# Altium project Switchberry.PrjPcb (part 3 of 3)

## Sheet 13-I225_2.SchDoc
size B; SheetNumber: 13; SheetTotal: 13
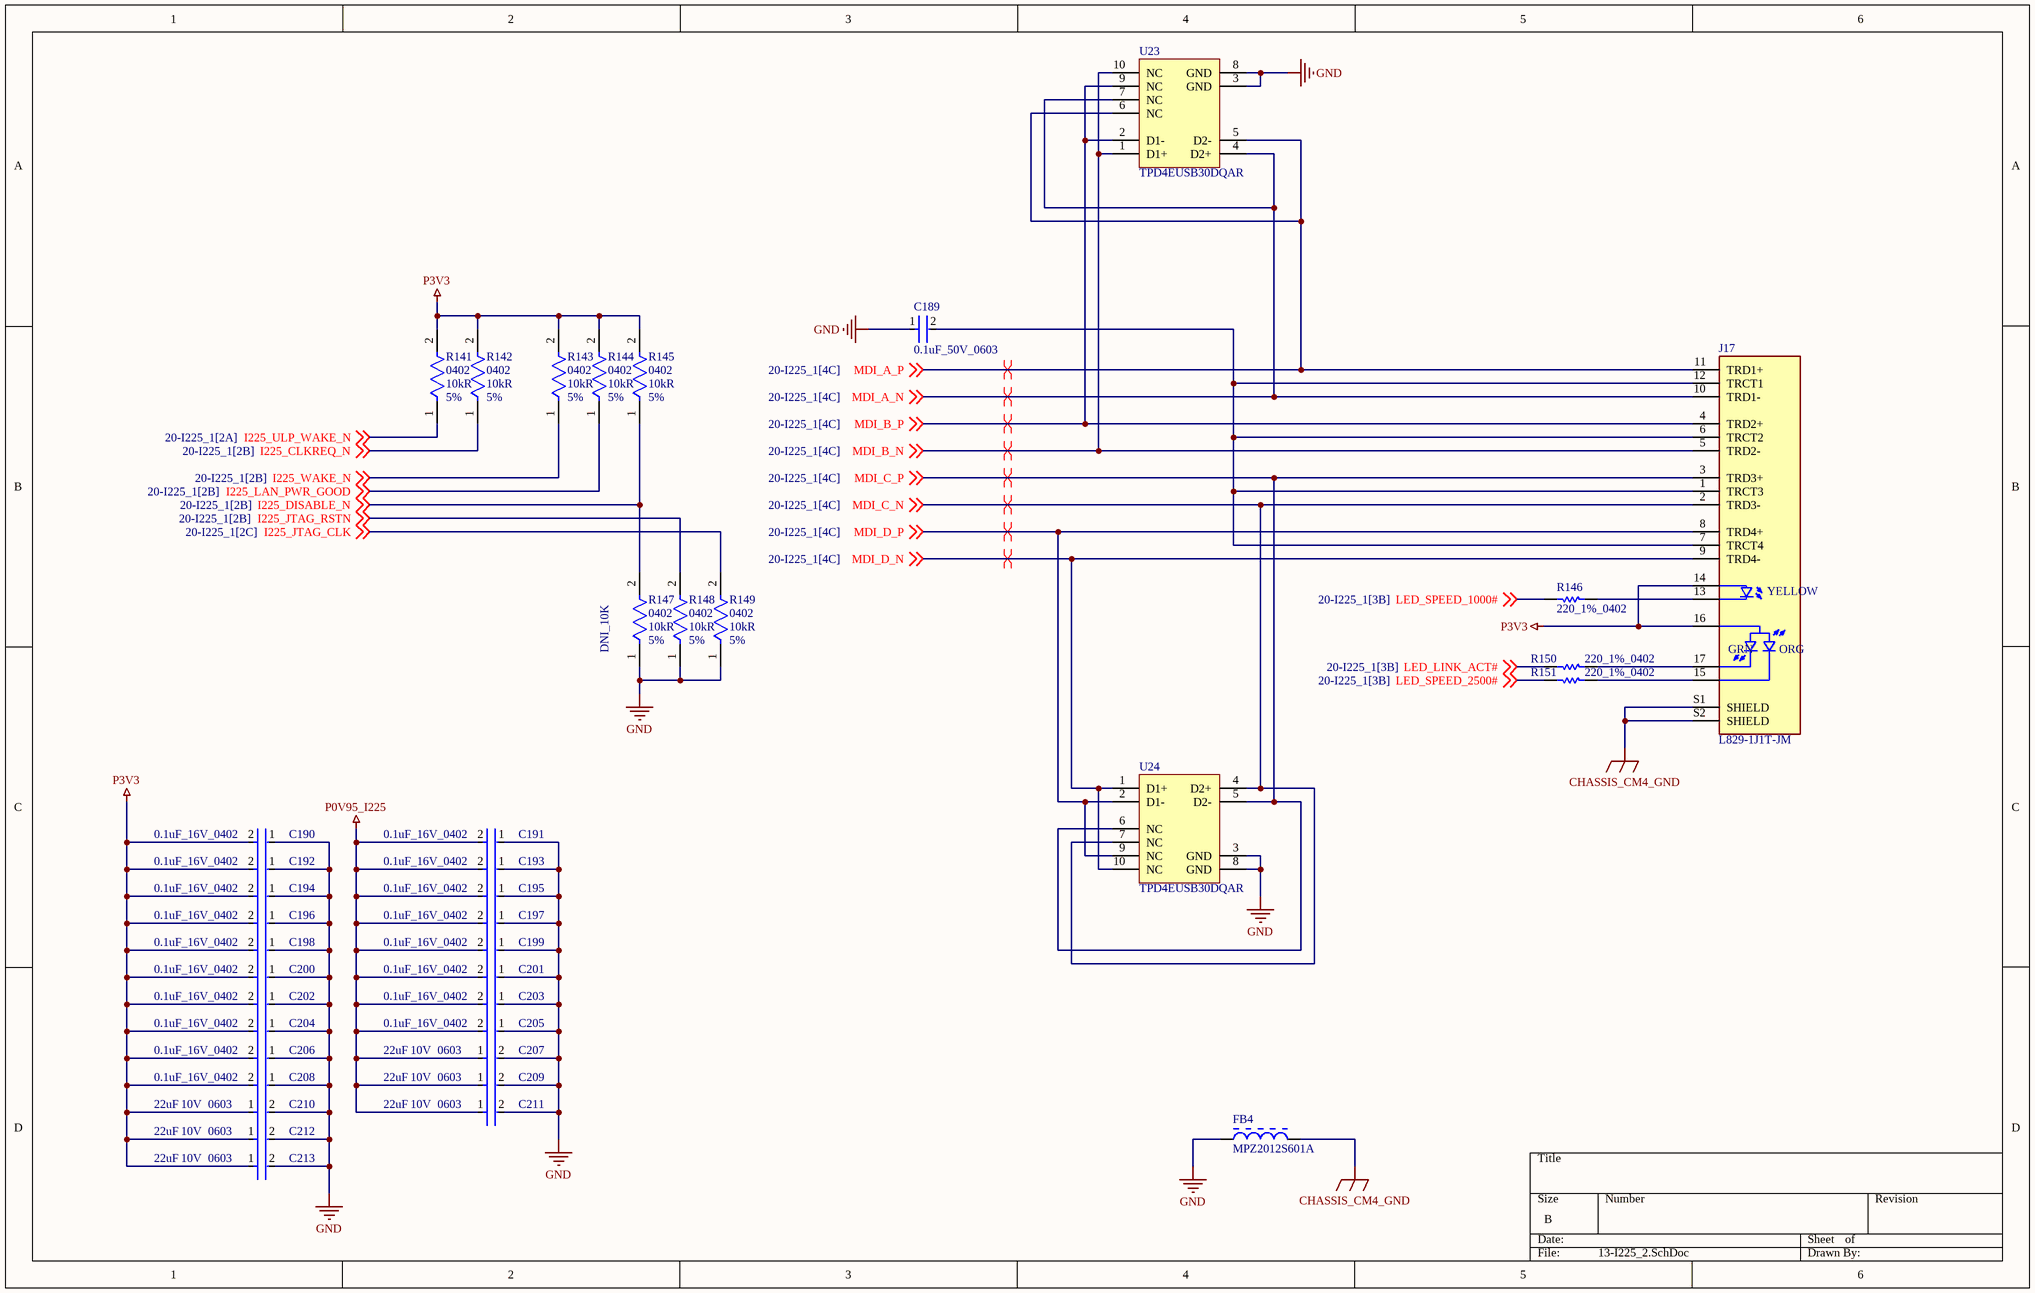
[diagram p9: 13-I225_2.SchDoc]

### Parts
C189  0.1uF_50V_0603  [FP-C0603-CJ-MFG]
C190  0.1uF_16V_0402  [FP-GRM15-MFG]
C191  0.1uF_16V_0402  [FP-GRM15-MFG]
C192  0.1uF_16V_0402  [FP-GRM15-MFG]
C193  0.1uF_16V_0402  [FP-GRM15-MFG]
C194  0.1uF_16V_0402  [FP-GRM15-MFG]
C195  0.1uF_16V_0402  [FP-GRM15-MFG]
C196  0.1uF_16V_0402  [FP-GRM15-MFG]
C197  0.1uF_16V_0402  [FP-GRM15-MFG]
C198  0.1uF_16V_0402  [FP-GRM15-MFG]
C199  0.1uF_16V_0402  [FP-GRM15-MFG]
C200  0.1uF_16V_0402  [FP-GRM15-MFG]
C201  0.1uF_16V_0402  [FP-GRM15-MFG]
C202  0.1uF_16V_0402  [FP-GRM15-MFG]
C203  0.1uF_16V_0402  [FP-GRM15-MFG]
C204  0.1uF_16V_0402  [FP-GRM15-MFG]
C205  0.1uF_16V_0402  [FP-GRM15-MFG]
C206  0.1uF_16V_0402  [FP-GRM15-MFG]
C207  Capacitance: 22uF  Voltage Rating: 10V  Case Code (Imperial): 0603  [FP-GRM188-0_2-IPC_C]  (hidden comment: GRM188R61A226ME15D)
C208  0.1uF_16V_0402  [FP-GRM15-MFG]
C209  Capacitance: 22uF  Voltage Rating: 10V  Case Code (Imperial): 0603  [FP-GRM188-0_2-IPC_C]  (hidden comment: GRM188R61A226ME15D)
C210  Capacitance: 22uF  Voltage Rating: 10V  Case Code (Imperial): 0603  [FP-GRM188-0_2-IPC_C]  (hidden comment: GRM188R61A226ME15D)
C211  Capacitance: 22uF  Voltage Rating: 10V  Case Code (Imperial): 0603  [FP-GRM188-0_2-IPC_C]  (hidden comment: GRM188R61A226ME15D)
C212  Capacitance: 22uF  Voltage Rating: 10V  Case Code (Imperial): 0603  [FP-GRM188-0_2-IPC_C]  (hidden comment: GRM188R61A226ME15D)
C213  Capacitance: 22uF  Voltage Rating: 10V  Case Code (Imperial): 0603  [FP-GRM188-0_2-IPC_C]  (hidden comment: GRM188R61A226ME15D)
FB4  MPZ2012S601A  [TDK-MPZ2012_V]
J17  L829-1J1T-JM  [BEL_L829-1J1T-JM]
R141  Case/Package: 0402  Resistance: 10kR  Tolerance: 5%  [FP-CRCW0402-e3-IPC_B]  (hidden comment: CRCW040210K0JNED)
R142  Case/Package: 0402  Resistance: 10kR  Tolerance: 5%  [FP-CRCW0402-e3-IPC_B]  (hidden comment: CRCW040210K0JNED)
R143  Case/Package: 0402  Resistance: 10kR  Tolerance: 5%  [FP-CRCW0402-e3-IPC_B]  (hidden comment: CRCW040210K0JNED)
R144  Case/Package: 0402  Resistance: 10kR  Tolerance: 5%  [FP-CRCW0402-e3-IPC_B]  (hidden comment: CRCW040210K0JNED)
R145  Case/Package: 0402  Resistance: 10kR  Tolerance: 5%  [FP-CRCW0402-e3-IPC_B]  (hidden comment: CRCW040210K0JNED)
R146  220_1%_0402  [RESC1005X40X25LL10T10]
R147  DNI_10K  Case/Package: 0402  Resistance: 10kR  Tolerance: 5%  [FP-CRCW0402-e3-IPC_B]  (no BOM)
R148  Case/Package: 0402  Resistance: 10kR  Tolerance: 5%  [FP-CRCW0402-e3-IPC_B]  (hidden comment: CRCW040210K0JNED)
R149  Case/Package: 0402  Resistance: 10kR  Tolerance: 5%  [FP-CRCW0402-e3-IPC_B]  (hidden comment: CRCW040210K0JNED)
R150  220_1%_0402  [RESC1005X40X25LL10T10]
R151  220_1%_0402  [RESC1005X40X25LL10T10]
U23  TPD4EUSB30DQAR  [DQA0010A_V]
U24  TPD4EUSB30DQAR  [DQA0010A_V]

### Nets
CHASSIS_CM4_GND: FB4.2 J17.S1(SHIELD) J17.S2(SHIELD)
GND: C189.1 C190.1 C191.1 C192.1 C193.1 C194.1 C195.1 C196.1 C197.1 C198.1 C199.1 C200.1 C201.1 C202.1 C203.1 C204.1 C205.1 C206.1 C207.2 C208.1 C209.2 C210.2 C211.2 C212.2 C213.2 FB4.1 R147.1 R148.1 R149.1 U23.3(GND) U23.8(GND) U24.3(GND) U24.8(GND)
P0V95_I225: C191.2 C193.2 C195.2 C197.2 C199.2 C201.2 C203.2 C205.2 C207.1 C209.1 C211.1
P3V3: C190.2 C192.2 C194.2 C196.2 C198.2 C200.2 C202.2 C204.2 C206.2 C208.2 C210.1 C212.1 C213.1 J17.14(YA_1) J17.16(CA) R141.2 R142.2 R143.2 R144.2 R145.2
I225_CLKREQ_N: R142.1 ; off-sheet I225_CLKREQ_N
I225_DISABLE_N: R145.1 R147.2 ; off-sheet I225_DISABLE_N
I225_JTAG_CLK: R149.2 ; off-sheet I225_JTAG_CLK
I225_JTAG_RSTN: R148.2 ; off-sheet I225_JTAG_RSTN
I225_LAN_PWR_GOOD: R144.1 ; off-sheet I225_LAN_PWR_GOOD
I225_ULP_WAKE_N: R141.1 ; off-sheet I225_ULP_WAKE_N
I225_WAKE_N: R143.1 ; off-sheet I225_WAKE_N
LED_LINK_ACT#: R150.2 ; off-sheet LED_LINK_ACT#
LED_SPEED_1000#: R146.2 ; off-sheet LED_SPEED_1000#
LED_SPEED_2500#: R151.2 ; off-sheet LED_SPEED_2500#
MDI_A_N: J17.10(TRD1-) U23.4(D2+) U23.7(NC) ; off-sheet MDI_A_N
MDI_A_P: J17.11(TRD1+) U23.5(D2-) U23.6(NC) ; off-sheet MDI_A_P
MDI_B_N: J17.5(TRD2-) U23.1(D1+) U23.10(NC) ; off-sheet MDI_B_N
MDI_B_P: J17.4(TRD2+) U23.2(D1-) U23.9(NC) ; off-sheet MDI_B_P
MDI_C_N: J17.2(TRD3-) U24.4(D2+) U24.7(NC) ; off-sheet MDI_C_N
MDI_C_P: J17.3(TRD3+) U24.5(D2-) U24.6(NC) ; off-sheet MDI_C_P
MDI_D_N: J17.9(TRD4-) U24.1(D1+) U24.10(NC) ; off-sheet MDI_D_N
MDI_D_P: J17.8(TRD4+) U24.2(D1-) U24.9(NC) ; off-sheet MDI_D_P
NetC189_2: C189.2 J17.1(TRCT3) J17.6(TRCT2) J17.7(TRCT4) J17.12(TRCT1)
NetJ17_13: J17.13(YK_1) R146.1
NetJ17_15: J17.15(OK_1) R151.1
NetJ17_17: J17.17(GK_1) R150.1

### Layout directives
differential pair: MDI_A_N, MDI_A_P, MDI_B_N, MDI_B_P, MDI_C_N, MDI_C_P, MDI_D_N, MDI_D_P

### Notes on the sheet
- (in symbol L829-1J1T-JM) YELLOW; GRN; ORG

### Library data of the parts
C189 = CMP-2006-03300-2: CAP CER 0.1UF 50V X7R 0603; Manufacturer Part Number: C0603X104K5RACTU; Manufacturer: Kemet; Capacitance: 100nF; Material: Ceramic; Tolerance: 10%; Value: 100nF; Temperature Coefficient: 15%; Temperature Range High: +125°C; Temperature Range Low: -55°C; Voltage: 50V; ComponentLink2Description: Datasheet; RoHS: TRUE; ComponentLink2URL: https://content.kemet.com/datasheets/KEM_C1013_X7R_FT-CAP_SMD.pdf; Device Class L3: Ceramic Capacitors; Device Class L2: Capacitors; Package: C0603-CJ; Height: 0.95mm; Device Class L1: Passive Components; Temperature Characteristic: X7R; Lead Free: Yes; Digikey Description: CAP CER 0.1UF 50V X7R 0603; Automotive: No; Mouser Description: Capacitor; Ceramic; Cap 0.1uF; Tol+10%; SMT; Flexible Termination; Vol-Rtg 50V; TR; Temperature: -55°C to +125°C; Octopart: https://octopart.com/c0603x104k5ractu-kemet-9145062; Category: Cap; Voltage Rating: 50V; Ipc Land Pattern Name: CAPC16080X80
C190-C206 C208 = CMP-2100-03641-2: CAP CER 0.1UF 16V X7R 0402; Manufacturer Part Number: GRM155R71C104KA88D; Manufacturer: Murata; Standoff Height: 0mm; Tolerance: 10%; Voltage Rating: 16Vdc; Material: Ceramic; Capacitance: 0.10μF; Value: 0.10μF; RoHS: TRUE; Temperature Characteristic: X7R; Octopart: https://octopart.com/grm155r71c104ka88d-murata-196880; Digikey Description: CAP CER 0.1UF 16V X7R 0402; Device Class L3: Ceramic Capacitors; Height: 0.55mm; ComponentLink2Description: Datasheet; Temperature Range Low: -55°C; Ipc Land Pattern Name: CAPC10050X219; ComponentLink2URL: https://search.murata.co.jp/Ceramy/image/img/A01X/G101/ENG/GRM155R71H471KA01-01A.pdf; Device Class L1: Passive Components; Lead Free: yes; Category: Cap; Package: GRM15; Temperature: -55°C to +125°C; Device Class L2: Capacitors; Temperature Range High: +125°C; Mouser Description: 0402 0.1 uF 16V ±10 % Tolerance X7R SMT Multilayer Ceramic Capacitor
C207 C209-C213 = CMP-2000-06337-3: Chip Multilayer Ceramic Capacitors for General Purpose, 0603, 22uF, X5R, 15%, 20%, 10V; Tolerance: 20%; Weight: 0.000222oz; Material: Ceramic; Depth: 0.8mm; Length: 1.6mm; Termination: SMD/SMT; Packaging: Tape and Reel; Width: 0.8mm; Mount: Surface Mount; Voltage Rating (DC): 10V; Case/Package: 0603; Thickness: 0.039inch; REACH SVHC: No SVHC; Dielectric: X5R; Height: 0.8mm; Package Quantity: 4000; Case Code (Metric): 1608; Min Operating Temperature: -55°C; Lead Free: Lead Free; Max Operating Temperature: 85°C
FB4 = CMP-2000-05400-1: Chip Bead for Power Line, 600 Ohm, +/- 25%, 2 A, -55 to 125 degC, 2-Pin SMD (0805), RoHS, Tape and Reel; Manufacturer: TDK; Maximum DC Current: 2A; Impedance: 600Ohms; Test Frequency: 100MHz; Case Length: 2mm; Maximum DC Resistance: 100mOhms; Case Height: 0.85mm; Case Width: 1.25mm; Factory Pack Quantity: 4000; Operating Temperature Range: -55Cto+125C; Packaging: Reel; Datasheet URL: https://datasheet.ciiva.com/23763/1750041-23763249.pdf; Manufacturer URL: http://www.tdk.com/; Product Category: EMIFilterBeads,Chips&Arrays; Tolerance: 25%; Product: FerriteChipBeads; Package / Case: 0805(2012metric); RoHS: Details; Dimensions: 1.25mmWx2mmLx0.85mmH; Datasheet Version: Jul-13; Termination Style: SMD/SMT; Package Reference: 805; Brand: TDK; Package Description: 2-Pin Surface Mount Device, Body 2 x 1.25 mm
J17 = L829-1J1T-JM: MagJack 2.5GBASE-T | 1X1 | OG/Y LED | -40 to 85C | RoHS; MF: Bel Magnetic Solutions; MP: L829-1J1T-JM; DigiKey-Purchase-URL: https://snapeda.com/shop?store=DigiKey&id=2758678; SnapEDA_Link: https://www.snapeda.com/parts/L829-1J1T-JM/Bel%20Magnetic%20Solutions/view-part/2758678/?ref=snap; Digi-Key_Part_Number: 507-2068-ND; Package: None; Value: *
R141-R145 R147-R149 = CMP-2002-08136-3: RES Thick Film, 10kΩ, 5%, 0.063W, 200ppm/°C, 0402; Voltage Rating: 50V; Power Rating: 63mW; Military Standard: Not; Packaging: Tape and Reel; Case Code (Imperial): 0402; Min Operating Temperature: -55°C; Case Code (Metric): 1005; Temperature Coefficient: 200ppm/°C; Termination: SMD/SMT; Composition: Thick Film; Depth: 0.5mm; Number of Terminations: 2; Contact Plating: Tin; Height: 0.016inch; Width: 0.5mm; Max Operating Temperature: 155°C; Features: Automotive AEC-Q200; Length: 1mm; Radiation Hardening: No; Max Power Dissipation: 63mW; Mount: Surface Mount; Package Quantity: 1; Weight: 2.3E-05oz
R146 R150 R151 = CMP-2002-03891-1: Part Number: RK73H1ETTP2200F; Manufacturer: KOA Speer
U23 U24 = CMP-0326-00027-3: ESD Solution for Super-Speed (6 GBPS) USB 3.0 Interface, 4 Channels, -40 to +85 degC, 10-pin SON (DQA), Green (RoHS & no Sb/Br); Manufacturer: Texas Instruments; Differential Capacitance(pF): 0.05; Serial ATA / eSATA: TRUE; IO Capacitance(Typ)(pF): 0.8; IO Leakage Current(nA): 10; IEC 61000-4-2 Air-Gap(+/- kV): 8; ComponentLink3Description: URL Link1; PartNumber: TPD4EUSB30DQAR; DatasheetVersion: SLVSAC2C; ComponentLink2URL: http://www.ti.com/general/docs/lit/getliterature.tsp?genericPartNumber=TPD4EUSB30&fileType=pdf; USB Super Speed: TRUE; Eco-Plan: Green (RoHS & no Sb/Br); Mounting Technology: Surface Mount; 1394 / Firewire: TRUE; PackageVersion: revB, Sep-2009; SubFamily: ESD Solution; USB Full Speed: TRUE; USB High Speed: TRUE; ComponentLink2Description: Datasheet; ComponentLink1URL: http://www.ti.com/; IEC 61000-4-2 Contact(+/- kV): 8; Breakdown Voltage(Min)(V): 8; PackageReference: DQA0010A; ComponentLink1Description: Manufacturer URL; PackageDescription: 10-Pin Plastic Small Outline No-Lead, 1 x 2.5 x 0.55 mm Body, 0.5 mm Pitch; ComponentLink3URL: SamplesURL:http://www.ti.com/product/tpd4eusb30#samples; HDMI: TRUE

## Nets that join several sheets
GND: 01-CM4_Conn (58 pins), 03-KSZ9567 (21 pins), 04-Switch_RJ45 (6 pins), 05-Switch_SFP_CM4_RJ45 (40 pins), 06-CM4_USB_HDMI_SDCard (19 pins), 07-KSZ9031_1G_BASET_XCVR (51 pins), 08-Power (51 pins), 10-RJ45_Protection (20 pins), 12-I225_1 (19 pins), 13-I225_2 (33 pins)
P0V95_I225: 12-I225_1 (7 pins), 13-I225_2 (11 pins)
P1V2: 07-KSZ9031_1G_BASET_XCVR (12 pins), 08-Power (5 pins)
P3V3: 03-KSZ9567 (R41.2), 04-Switch_RJ45 (11 pins), 05-Switch_SFP_CM4_RJ45 (15 pins), 06-CM4_USB_HDMI_SDCard (R28.2 U3.5), 07-KSZ9031_1G_BASET_XCVR (11 pins), 08-Power (17 pins), 12-I225_1 (18 pins), 13-I225_2 (20 pins)
P5V: 01-CM4_Conn (6 pins), 06-CM4_USB_HDMI_SDCard (5 pins), 08-Power (25 pins)
BRD_RST_N: 01-CM4_Conn (J15.45), 08-Power (R74.2 U9.1)
CM4_GPIO13: 01-CM4_Conn (J15.28), 12-I225_1 (U20.8)
CM4_GPIO19: 01-CM4_Conn (J15.26), 12-I225_1 (U20.4)
CM4_GPIO20: 01-CM4_Conn (J15.27), 12-I225_1 (R111.1 U20.15)
CM4_GPIO21: 01-CM4_Conn (J15.25), 12-I225_1 (U20.11)
CM4_GPIO26: 01-CM4_Conn (J15.24), 12-I225_1 (U20.1)
ETH_PAIR0_N: 01-CM4_Conn (J15.10), 07-KSZ9031_1G_BASET_XCVR (U2.2 U2.9 U4.3)
ETH_PAIR0_P: 01-CM4_Conn (J15.12), 07-KSZ9031_1G_BASET_XCVR (U2.1 U2.10 U4.2)
ETH_PAIR1_N: 01-CM4_Conn (J15.6), 07-KSZ9031_1G_BASET_XCVR (U2.4 U2.7 U4.6)
ETH_PAIR1_P: 01-CM4_Conn (J15.4), 07-KSZ9031_1G_BASET_XCVR (U2.5 U2.6 U4.5)
ETH_PAIR2_N: 01-CM4_Conn (J15.9), 07-KSZ9031_1G_BASET_XCVR (U4.8 U5.2 U5.9)
ETH_PAIR2_P: 01-CM4_Conn (J15.11), 07-KSZ9031_1G_BASET_XCVR (U4.7 U5.1 U5.10)
ETH_PAIR3_N: 01-CM4_Conn (J15.5), 07-KSZ9031_1G_BASET_XCVR (U4.11 U5.4 U5.7)
ETH_PAIR3_P: 01-CM4_Conn (J15.3), 07-KSZ9031_1G_BASET_XCVR (U4.10 U5.5 U5.6)
HDMI0_CEC: 01-CM4_Conn (J14.51), 06-CM4_USB_HDMI_SDCard (J7.13)
HDMI0_CLK_N: 01-CM4_Conn (J14.90), 06-CM4_USB_HDMI_SDCard (L7.2)
HDMI0_CLK_P: 01-CM4_Conn (J14.88), 06-CM4_USB_HDMI_SDCard (L7.3)
HDMI0_HP: 01-CM4_Conn (J14.53), 06-CM4_USB_HDMI_SDCard (J7.19)
HDMI0_SCL: 01-CM4_Conn (J14.100), 06-CM4_USB_HDMI_SDCard (J7.15)
HDMI0_SDA: 01-CM4_Conn (J14.99), 06-CM4_USB_HDMI_SDCard (J7.16)
HDMI0_TX0_N: 01-CM4_Conn (J14.84), 06-CM4_USB_HDMI_SDCard (L6.2)
HDMI0_TX0_P: 01-CM4_Conn (J14.82), 06-CM4_USB_HDMI_SDCard (L6.3)
HDMI0_TX1_N: 01-CM4_Conn (J14.78), 06-CM4_USB_HDMI_SDCard (L5.2)
HDMI0_TX1_P: 01-CM4_Conn (J14.76), 06-CM4_USB_HDMI_SDCard (L5.3)
HDMI0_TX2_N: 01-CM4_Conn (J14.72), 06-CM4_USB_HDMI_SDCard (L4.2)
HDMI0_TX2_P: 01-CM4_Conn (J14.70), 06-CM4_USB_HDMI_SDCard (L4.3)
I225_CLKREQ_N: 12-I225_1 (U18.3), 13-I225_2 (R142.1)
I225_DISABLE_N: 12-I225_1 (U18.2), 13-I225_2 (R145.1 R147.2)
I225_JTAG_CLK: 12-I225_1 (U18.29), 13-I225_2 (R149.2)
I225_JTAG_RSTN: 12-I225_1 (U18.16), 13-I225_2 (R148.2)
I225_LAN_PWR_GOOD: 12-I225_1 (U18.1), 13-I225_2 (R144.1)
I225_ULP_WAKE_N: 12-I225_1 (U18.4), 13-I225_2 (R141.1)
I225_WAKE_N: 12-I225_1 (U18.12), 13-I225_2 (R143.1)
LED_LINK_ACT#: 12-I225_1 (U18.30), 13-I225_2 (R150.2)
LED_SPEED_1000#: 12-I225_1 (U18.32), 13-I225_2 (R146.2)
LED_SPEED_2500#: 12-I225_1 (U18.31), 13-I225_2 (R151.2)
MDI_A_N: 12-I225_1 (U18.46), 13-I225_2 (J17.10 U23.4 U23.7)
MDI_A_P: 12-I225_1 (U18.45), 13-I225_2 (J17.11 U23.5 U23.6)
MDI_B_N: 12-I225_1 (U18.49), 13-I225_2 (J17.5 U23.1 U23.10)
MDI_B_P: 12-I225_1 (U18.48), 13-I225_2 (J17.4 U23.2 U23.9)
MDI_C_N: 12-I225_1 (U18.52), 13-I225_2 (J17.2 U24.4 U24.7)
MDI_C_P: 12-I225_1 (U18.51), 13-I225_2 (J17.3 U24.5 U24.6)
MDI_D_N: 12-I225_1 (U18.55), 13-I225_2 (J17.9 U24.1 U24.10)
MDI_D_P: 12-I225_1 (U18.54), 13-I225_2 (J17.8 U24.2 U24.9)
P1_LED0: 03-KSZ9567 (R31.2), 04-Switch_RJ45 (J1.27)
P1_LED1: 03-KSZ9567 (R32.2), 04-Switch_RJ45 (J1.30)
P1_TXRXA_N: 03-KSZ9567 (U1.2), 04-Switch_RJ45 (J1.21), 10-RJ45_Protection (U10.2 U10.9)
P1_TXRXA_P: 03-KSZ9567 (U1.1), 04-Switch_RJ45 (J1.15), 10-RJ45_Protection (U10.1 U10.10)
P1_TXRXB_N: 03-KSZ9567 (U1.5), 04-Switch_RJ45 (J1.16), 10-RJ45_Protection (U10.5 U10.6)
P1_TXRXB_P: 03-KSZ9567 (U1.4), 04-Switch_RJ45 (J1.23), 10-RJ45_Protection (U10.4 U10.7)
P1_TXRXC_N: 03-KSZ9567 (U1.7), 04-Switch_RJ45 (J1.24), 10-RJ45_Protection (U12.2 U12.9)
P1_TXRXC_P: 03-KSZ9567 (U1.6), 04-Switch_RJ45 (J1.18), 10-RJ45_Protection (U12.1 U12.10)
P1_TXRXD_N: 03-KSZ9567 (U1.9), 04-Switch_RJ45 (J1.19), 10-RJ45_Protection (U12.5 U12.6)
P1_TXRXD_P: 03-KSZ9567 (U1.8), 04-Switch_RJ45 (J1.26), 10-RJ45_Protection (U12.4 U12.7)
P2_LED0: 03-KSZ9567 (R33.2), 04-Switch_RJ45 (J2.31)
P2_LED1: 03-KSZ9567 (R34.2), 04-Switch_RJ45 (J2.34)
P2_TXRXA_N: 03-KSZ9567 (U1.13), 04-Switch_RJ45 (J2.13), 10-RJ45_Protection (U11.2 U11.9)
P2_TXRXA_P: 03-KSZ9567 (U1.12), 04-Switch_RJ45 (J2.6), 10-RJ45_Protection (U11.1 U11.10)
P2_TXRXB_N: 03-KSZ9567 (U1.16), 04-Switch_RJ45 (J2.5), 10-RJ45_Protection (U11.5 U11.6)
P2_TXRXB_P: 03-KSZ9567 (U1.15), 04-Switch_RJ45 (J2.11), 10-RJ45_Protection (U11.4 U11.7)
P2_TXRXC_N: 03-KSZ9567 (U1.18), 04-Switch_RJ45 (J2.10), 10-RJ45_Protection (U13.2 U13.9)
P2_TXRXC_P: 03-KSZ9567 (U1.17), 04-Switch_RJ45 (J2.3), 10-RJ45_Protection (U13.1 U13.10)
P2_TXRXD_N: 03-KSZ9567 (U1.21), 04-Switch_RJ45 (J2.2), 10-RJ45_Protection (U13.5 U13.6)
P2_TXRXD_P: 03-KSZ9567 (U1.20), 04-Switch_RJ45 (J2.8), 10-RJ45_Protection (U13.4 U13.7)
P3_LED0: 03-KSZ9567 (R35.2), 04-Switch_RJ45 (J2.27)
P3_LED1: 03-KSZ9567 (R36.2), 04-Switch_RJ45 (J2.30)
P3_TXRXA_N: 03-KSZ9567 (U1.25), 04-Switch_RJ45 (J2.21), 10-RJ45_Protection (U15.2 U15.9)
P3_TXRXA_P: 03-KSZ9567 (U1.24), 04-Switch_RJ45 (J2.15), 10-RJ45_Protection (U15.1 U15.10)
P3_TXRXB_N: 03-KSZ9567 (U1.27), 04-Switch_RJ45 (J2.16), 10-RJ45_Protection (U15.5 U15.6)
P3_TXRXB_P: 03-KSZ9567 (U1.26), 04-Switch_RJ45 (J2.23), 10-RJ45_Protection (U15.4 U15.7)
P3_TXRXC_N: 03-KSZ9567 (U1.29), 04-Switch_RJ45 (J2.24), 10-RJ45_Protection (U17.2 U17.9)
P3_TXRXC_P: 03-KSZ9567 (U1.28), 04-Switch_RJ45 (J2.18), 10-RJ45_Protection (U17.1 U17.10)
P3_TXRXD_N: 03-KSZ9567 (U1.32), 04-Switch_RJ45 (J2.19), 10-RJ45_Protection (U17.5 U17.6)
P3_TXRXD_P: 03-KSZ9567 (U1.31), 04-Switch_RJ45 (J2.26), 10-RJ45_Protection (U17.4 U17.7)
P4_LED0: 03-KSZ9567 (R37.2), 04-Switch_RJ45 (R53.2)
P4_LED1: 03-KSZ9567 (R38.2), 04-Switch_RJ45 (R54.2)
P4_TXRXA_N: 03-KSZ9567 (U1.35), 04-Switch_RJ45 (J3.10), 10-RJ45_Protection (U14.2 U14.9)
P4_TXRXA_P: 03-KSZ9567 (U1.34), 04-Switch_RJ45 (J3.11), 10-RJ45_Protection (U14.1 U14.10)
P4_TXRXB_N: 03-KSZ9567 (U1.38), 04-Switch_RJ45 (J3.5), 10-RJ45_Protection (U14.5 U14.6)
P4_TXRXB_P: 03-KSZ9567 (U1.37), 04-Switch_RJ45 (J3.4), 10-RJ45_Protection (U14.4 U14.7)
P4_TXRXC_N: 03-KSZ9567 (U1.40), 04-Switch_RJ45 (J3.2), 10-RJ45_Protection (U16.2 U16.9)
P4_TXRXC_P: 03-KSZ9567 (U1.39), 04-Switch_RJ45 (J3.3), 10-RJ45_Protection (U16.1 U16.10)
P4_TXRXD_N: 03-KSZ9567 (U1.43), 04-Switch_RJ45 (J3.9), 10-RJ45_Protection (U16.5 U16.6)
P4_TXRXD_P: 03-KSZ9567 (U1.42), 04-Switch_RJ45 (J3.8), 10-RJ45_Protection (U16.4 U16.7)
P5_LED0: 03-KSZ9567 (R39.2), 04-Switch_RJ45 (J1.31)
P5_LED1: 03-KSZ9567 (R40.2), 04-Switch_RJ45 (J1.34)
P5_TXRXA_N: 03-KSZ9567 (U1.113), 04-Switch_RJ45 (J1.13), 10-RJ45_Protection (U19.2 U19.9)
P5_TXRXA_P: 03-KSZ9567 (U1.112), 04-Switch_RJ45 (J1.6), 10-RJ45_Protection (U19.1 U19.10)
P5_TXRXB_N: 03-KSZ9567 (U1.116), 04-Switch_RJ45 (J1.5), 10-RJ45_Protection (U19.5 U19.6)
P5_TXRXB_P: 03-KSZ9567 (U1.115), 04-Switch_RJ45 (J1.11), 10-RJ45_Protection (U19.4 U19.7)
P5_TXRXC_N: 03-KSZ9567 (U1.118), 04-Switch_RJ45 (J1.10), 10-RJ45_Protection (U21.2 U21.9)
P5_TXRXC_P: 03-KSZ9567 (U1.117), 04-Switch_RJ45 (J1.3), 10-RJ45_Protection (U21.1 U21.10)
P5_TXRXD_N: 03-KSZ9567 (U1.121), 04-Switch_RJ45 (J1.2), 10-RJ45_Protection (U21.5 U21.6)
P5_TXRXD_P: 03-KSZ9567 (U1.120), 04-Switch_RJ45 (J1.8), 10-RJ45_Protection (U21.4 U21.7)
P6_RGMII_RXCLK: 03-KSZ9567 (U1.57), 07-KSZ9031_1G_BASET_XCVR (R14.1)
P6_RGMII_RXCTL: 03-KSZ9567 (U1.58), 07-KSZ9031_1G_BASET_XCVR (R15.1)
P6_RGMII_RXD0: 03-KSZ9567 (R13.2 U1.65), 07-KSZ9031_1G_BASET_XCVR (R16.1)
P6_RGMII_RXD1: 03-KSZ9567 (R12.2 U1.64), 07-KSZ9031_1G_BASET_XCVR (R17.1)
P6_RGMII_RXD2: 03-KSZ9567 (R11.2 U1.63), 07-KSZ9031_1G_BASET_XCVR (R18.1)
P6_RGMII_RXD3: 03-KSZ9567 (R10.2 U1.62), 07-KSZ9031_1G_BASET_XCVR (R19.1)
P6_RGMII_TXCLK: 03-KSZ9567 (U1.48), 07-KSZ9031_1G_BASET_XCVR (R20.1)
P6_RGMII_TXCTL: 03-KSZ9567 (U1.49), 07-KSZ9031_1G_BASET_XCVR (R21.1)
P6_RGMII_TXD0: 03-KSZ9567 (U1.55), 07-KSZ9031_1G_BASET_XCVR (R22.1)
P6_RGMII_TXD1: 03-KSZ9567 (U1.54), 07-KSZ9031_1G_BASET_XCVR (R23.1)
P6_RGMII_TXD2: 03-KSZ9567 (U1.53), 07-KSZ9031_1G_BASET_XCVR (R24.1)
P6_RGMII_TXD3: 03-KSZ9567 (U1.52), 07-KSZ9031_1G_BASET_XCVR (R25.1)
PCIE_CLK_N: 01-CM4_Conn (J14.12), 12-I225_1 (R118.1)
PCIE_CLK_P: 01-CM4_Conn (J14.10), 12-I225_1 (R117.1)
PCIE_PERST_N: 01-CM4_Conn (J14.9), 12-I225_1 (R119.1 U18.13)
PCIE_RX_N: 01-CM4_Conn (J14.18), 12-I225_1 (C184.1)
PCIE_RX_P: 01-CM4_Conn (J14.16), 12-I225_1 (C32.1)
PCIE_TX_N: 01-CM4_Conn (J14.24), 12-I225_1 (R116.1)
PCIE_TX_P: 01-CM4_Conn (J14.22), 12-I225_1 (R115.1)
PHY_INT_N: 01-CM4_Conn (J15.47), 07-KSZ9031_1G_BASET_XCVR (R87.2)
PHY_MDC: 01-CM4_Conn (J15.54), 07-KSZ9031_1G_BASET_XCVR (R84.1)
PHY_MDIO: 01-CM4_Conn (J15.50), 07-KSZ9031_1G_BASET_XCVR (R86.1)
PHY_RST_N: 07-KSZ9031_1G_BASET_XCVR (R83.2), 08-Power (R81.1)
SD_CLK: 01-CM4_Conn (J15.57), 06-CM4_USB_HDMI_SDCard (SD1.5)
SD_CMD: 01-CM4_Conn (J15.62), 06-CM4_USB_HDMI_SDCard (SD1.3)
SD_DAT0: 01-CM4_Conn (J15.63), 06-CM4_USB_HDMI_SDCard (SD1.7)
SD_DAT1: 01-CM4_Conn (J15.67), 06-CM4_USB_HDMI_SDCard (SD1.8)
SD_DAT2: 01-CM4_Conn (J15.69), 06-CM4_USB_HDMI_SDCard (SD1.1)
SD_DAT3: 01-CM4_Conn (J15.61), 06-CM4_USB_HDMI_SDCard (SD1.2)
SD_PWR_ON: 01-CM4_Conn (J15.75), 06-CM4_USB_HDMI_SDCard (R28.1 U3.4)
SFP1_SCL: 01-CM4_Conn (J15.56), 05-Switch_SFP_CM4_RJ45 (J4.5 R4.2)
SFP1_SDA: 01-CM4_Conn (J15.58), 05-Switch_SFP_CM4_RJ45 (J4.4 R3.2)
SFP_SW_N: 03-KSZ9567 (U1.78), 05-Switch_SFP_CM4_RJ45 (J4.12)
SFP_SW_P: 03-KSZ9567 (U1.79), 05-Switch_SFP_CM4_RJ45 (J4.13)
SPI0_CE0: 01-CM4_Conn (J15.39), 03-KSZ9567 (R44.2)
SPI0_CLK: 01-CM4_Conn (J15.38), 03-KSZ9567 (R45.1)
SPI0_MISO: 01-CM4_Conn (J15.40), 03-KSZ9567 (R47.1)
SPI0_MOSI: 01-CM4_Conn (J15.44), 03-KSZ9567 (R46.1)
SW_INTR_N: 01-CM4_Conn (J15.41), 03-KSZ9567 (R41.1 U1.94)
SW_RST_N: 03-KSZ9567 (R43.2), 08-Power (R75.1)
SW_SFP_N: 03-KSZ9567 (U1.82), 05-Switch_SFP_CM4_RJ45 (J4.19)
SW_SFP_P: 03-KSZ9567 (U1.81), 05-Switch_SFP_CM4_RJ45 (J4.18)
USB_N: 01-CM4_Conn (J14.3), 06-CM4_USB_HDMI_SDCard (L3.2)
USB_P: 01-CM4_Conn (J14.5), 06-CM4_USB_HDMI_SDCard (L3.3)